# EAGLE design Energy SensorRevB (EAGLE 6.4)
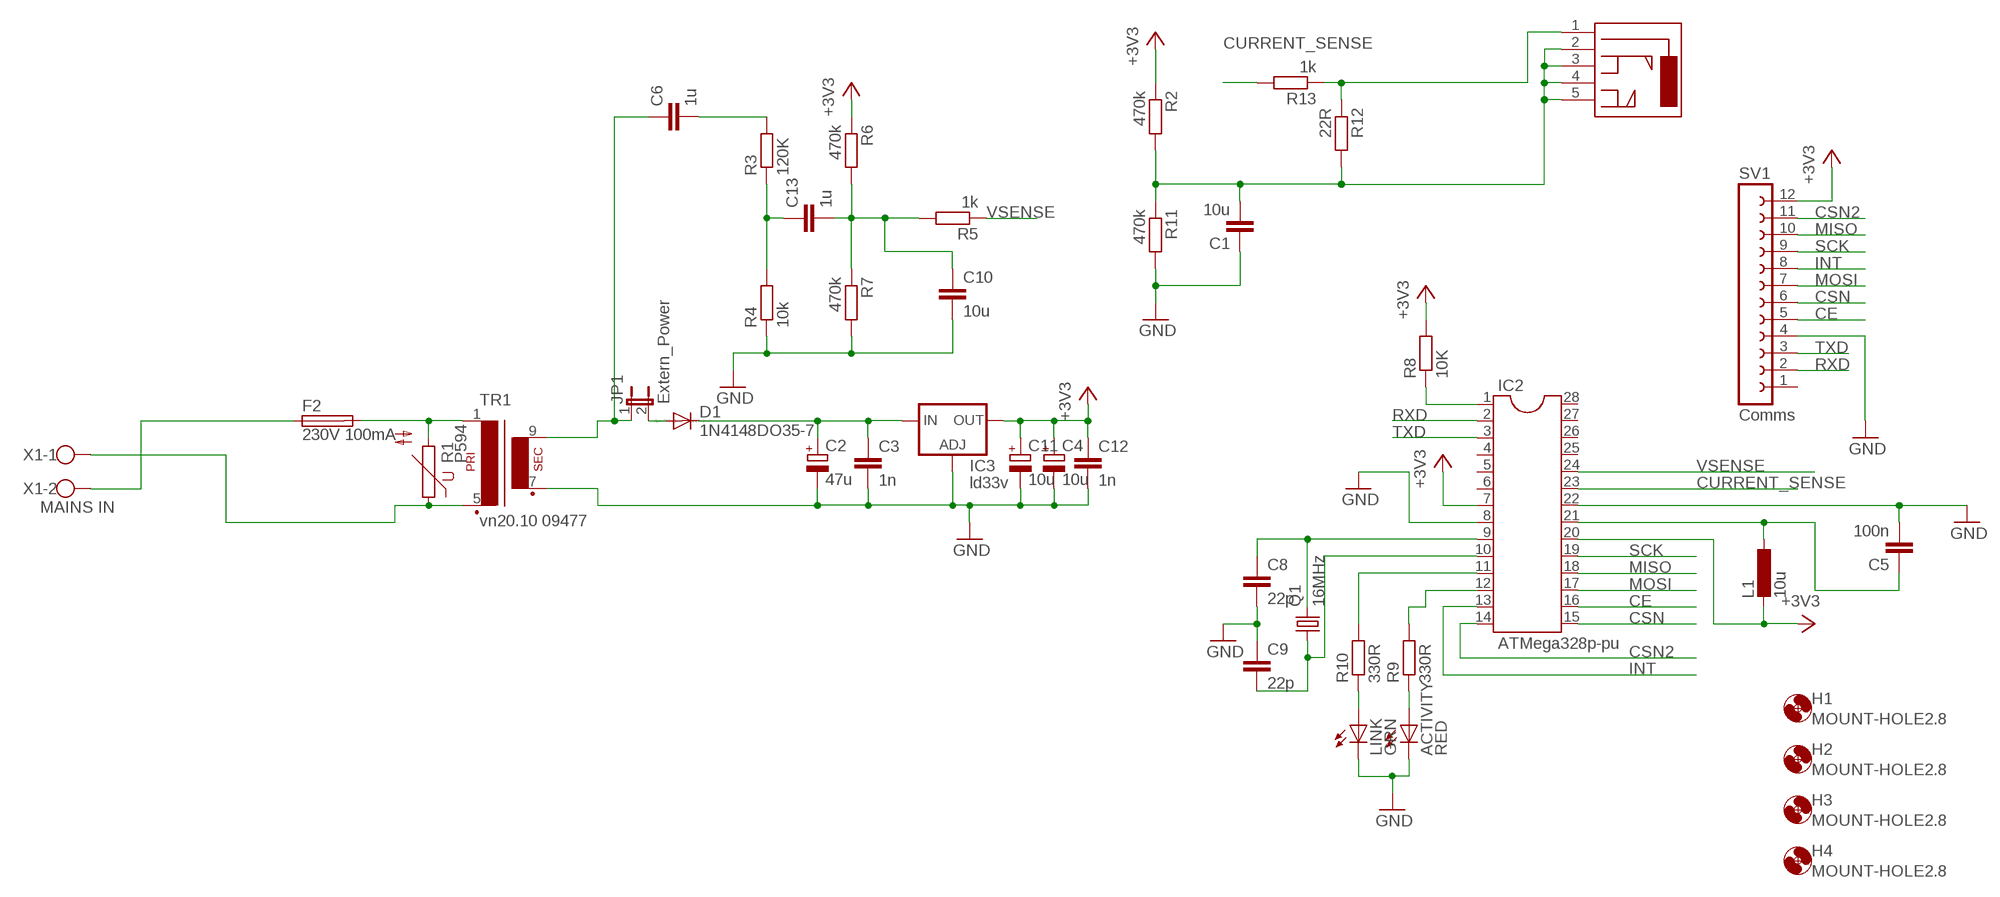
[diagram p0: schematic, sheet 1]

## Parts
ACTIVITY  RED  LED5MM  [LED5MM]
C1  10u  C-EUC1206K  [C1206K]
C2  47u  CPOL-EUE3.5-10  [E3,5-10]
C3  1n  C-EU025-025X050  [C025-025X050]
C4  10u  CPOL-EUE3.5-8  [E3,5-8]
C5  100n  C-EUC1206K  [C1206K]
C6  1u  C-EUC1206K  [C1206K]
C8  22p  C-EU025-025X050  [C025-025X050]
C9  22p  C-EU025-025X050  [C025-025X050]
C10  10u  C-EUC1206K  [C1206K]
C11  10u  CPOL-EUE3.5-8  [E3,5-8]
C12  1n  C-EU025-025X050  [C025-025X050]
C13  1u  C-EUC1206K  [C1206K]
D1  1N4148DO35-7  [DO35-7]
F2  230V 100mA  SH22,5A  [SH22,5A]
H1  MOUNT-HOLE2.8  [2,8]
H2  MOUNT-HOLE2.8  [2,8]
H3  MOUNT-HOLE2.8  [2,8]
H4  MOUNT-HOLE2.8  [2,8]
IC2  ATMega328p-pu  DIL28-3  [DIL28-3]
IC3  ld33v  LM317TL  [317TL]
JP1  Extern_Power  JP1E  [JP1]
L1  10u  L-EUL3230M  [L3230M]
LINK  GRN  LED5MM  [LED5MM]
Q1  16MHz  CRYSTALHC49S  [HC49/S]
R1  P594  [P594]
R2  470k  R-EU_0207/7  [0207/7]
R3  120K  R-EU_0207/7  [0207/7]
R4  10k  R-EU_0207/7  [0207/7]
R5  1k  R-EU_0207/7  [0207/7]
R6  470k  R-EU_0207/7  [0207/7]
R7  470k  R-EU_0207/7  [0207/7]
R8  10K  R-EU_0207/7  [0207/7]
R9  330R  R-EU_0207/7  [0207/7]
R10  330R  R-EU_0207/7  [0207/7]
R11  470k  R-EU_0207/7  [0207/7]
R12  22R  R-EU_R1206  [R1206]
R13  1k  R-EU_0207/7  [0207/7]
SV1  Comms  FE12W  [FE12W]
TR1  vn20.10 09477  VV11  [VV11]
U$1  3.5MMJACK  [3.5MMJACK]
X1  MAINS IN  W237-102  [W237-102]

## Nets
+3V3: C4.+ C11.+ C12.1 IC2.7 IC2.20 IC3.2(OUT) L1.2 R2.1 R6.1 R8.2 SV1.12
CE: IC2.16 SV1.5
CSN: IC2.15 SV1.6
CSN2: IC2.14 SV1.11
CURRENT_SENSE: IC2.23 R13.2
GND: ACTIVITY.K(C) C1.1 C2.- C3.2 C4.- C5.2 C8.2 C9.1 C10.2 C11.- C12.2 IC2.8 IC2.22 IC3.1(ADJ) LINK.K(C) R4.1 R7.2 R11.2 SV1.4 TR1.7(S3)
INT: IC2.13 SV1.8
MISO: IC2.18 SV1.10
MOSI: IC2.17 SV1.7
N$1: C1.2 R2.2 R11.1 R12.2 U$1.2 U$1.3 U$1.4 U$1.5
N$2: R1.1 TR1.5(P2) X1.1
N$3: D1.A JP1.2
N$4: C6.2 R3.2
N$5: C6.1 JP1.1 TR1.9(S4)
N$6: R12.1 R13.1 U$1.1
N$7: C2.+ C3.1 D1.C IC3.3(IN)
N$8: C5.1 IC2.21 L1.1
N$9: C13.1 R3.1 R4.2
N$10: C10.1 C13.2 R5.2 R6.2 R7.1
N$12: C8.1 IC2.9 Q1.2
N$13: C9.2 IC2.10 Q1.1
N$14: LINK.A R10.1
N$15: ACTIVITY.A R9.1
N$16: IC2.1 R8.1
N$17: IC2.12 R9.2
N$18: IC2.11 R10.2
N$19: F2.2 R1.2 TR1.1
N$22: F2.1 X1.2
RXD: IC2.2 SV1.2
SCK: IC2.19 SV1.9
TXD: IC2.3 SV1.3
VSENSE: IC2.24 R5.1
Unconnected: IC2.4 IC2.5 IC2.6 IC2.25 IC2.26 IC2.27 IC2.28 SV1.1

## Library data of the parts
ACTIVITY LINK = led:LED: LED OSRAM: - CHIPLED LG R971, LG N971, LY N971, LG Q971, LY Q971, LO R971, LY R971 LH N974, LH R974 LS Q976, LO Q976, LY Q976 LO Q996 - Hyper CHIPLED LW Q18S LB Q993, LB Q99A, LB R99A - SideLED LS A670, LO A670, LY A670, LG A670, LP A670 LB A673, LV A673, LT A673, LW A673 LH A674 LY A675 LS A676, LA A676, LO A676, LY A676, LW A676 LS A679, LY A679, LG A679 - Hyper Micro SIDELED® LS Y876, LA Y876, LO Y876, LY Y876 LT Y87S - SmartLED LW L88C, LW L88S LB L89C, LB L89S, LG L890 LS L89K, LO L89K, LY L89K LS L896, LA L896, LO L896, LY L896 - TOPLED LS T670, LO T670, LY T670, LG T670, LP T670 LSG T670, LSP T670, LSY T670, LOP T670, LYG T670 LG T671, LOG T671, LSG T671 LB T673, LV T673, LT T673, LW T673 LH T674 LS T676, LA T676, LO T676, LY T676, LB T676, LH T676, LSB T676, LW T676 LB T67C, LV T67C, LT T67C, LS T67K, LO T67K, LY T67K, LW E67C LS E67B, LA E67B, LO E67B, LY E67B, LB E67C, LV E67C, LT E67C LW T67C LS T679, LY T679, LG T679 LS T770, LO T770, LY T770, LG T770, LP T770 LB T773, LV T773, LT T773, LW T773 LH T774 LS E675, LA E675, LY E675, LS T675 LS T776, LA T776, LO T776, LY T776, LB T776 LHGB T686 LT T68C, LB T68C - Hyper Mini TOPLED® LB M676 - Mini TOPLED Santana® LG M470 LS M47K, LO M47K, LY M47K Source: http://www.osram.convergy.de LUXEON: - LUMILED® LXK2-PW12-R00, LXK2-PW12-S00, LXK2-PW14-U00, LXK2-PW14-V00 LXK2-PM12-R00, LXK2-PM12-S00, LXK2-PM14-U00 LXK2-PE12-Q00, LXK2-PE12-R00, LXK2-PE12-S00, LXK2-PE14-T00, LXK2-PE14-U00 LXK2-PB12-K00, LXK2-PB12-L00, LXK2-PB12-M00, LXK2-PB14-N00, LXK2-PB14-P00, LXK2-PB14-Q00 LXK2-PR12-L00, LXK2-PR12-M00, LXK2-PR14-Q00, LXK2-PR14-R00 LXK2-PD12-Q00, LXK2-PD12-R00, LXK2-PD12-S00 LXK2-PH12-R00, LXK2-PH12-S00 LXK2-PL12-P00, LXK2-PL12-Q00, LXK2-PL12-R00 Source: www.luxeon.com KINGBRIGHT: KA-3528ASYC Source: www.kingbright.com
C1 C3 C5 C6 C8-C10 C12 C13 = rcl:C-EU: CAPACITOR, European symbol
C2 C4 C11 = rcl:CPOL-EU: POLARIZED CAPACITOR, European symbol
D1 = diode:1N4148: DIODE high speed (Philips)
F2 = fuse:SH22,5A: FUSE HOLDER grid 22,5mm, isolated cap OGN0031 8201, Schurter (Buerklin); MPN: 0031.7701.11; OC_FARNELL: unknown; OC_NEWARK: 04F1224
H1-H4 = holes:MOUNT-HOLE: MOUNTING HOLE with drill center marker
IC2 = ic-package:DIL28: Dual In Line
IC3 = v-reg:LM317TL: VOLTAGE REGULATOR
JP1 = jumper:JP1E: JUMPER
L1 = rcl:L-EU: INDUCTOR, European symbol
Q1 = crystal:CRYSTAL: CRYSTAL; OC_FARNELL: 1667008; OC_NEWARK: unknown
R1 = varistor:P594: VARISTOR
R2-R13 = rcl:R-EU_: RESISTOR, European symbol
SV1 = con-lsta:FE12W: FEMALE HEADER; OC_FARNELL: unknown; OC_NEWARK: unknown
TR1 = xformer:VV11: TRANSFORMER 1 primary winding, 1 secondary winding BLOCK
U$1 = jack:3.5MMJACK
X1 = con-wago-500:W237-102: WAGO SCREW CLAMP; MPN: 237-102; OC_FARNELL: unknown; OC_NEWARK: 70K9898

## Board
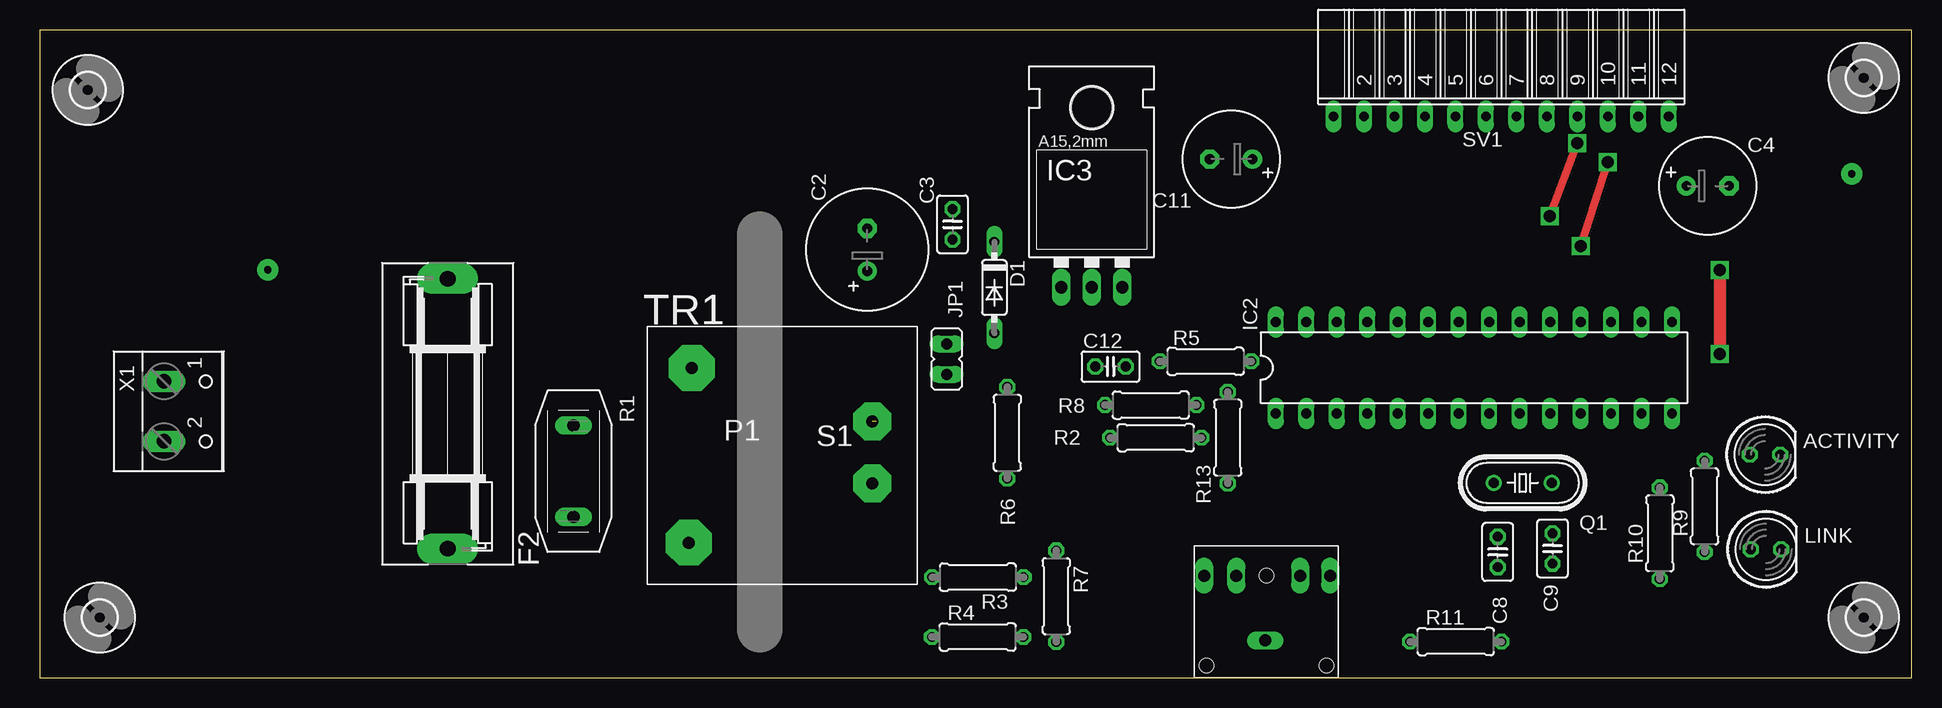
[diagram p1: board, top side]
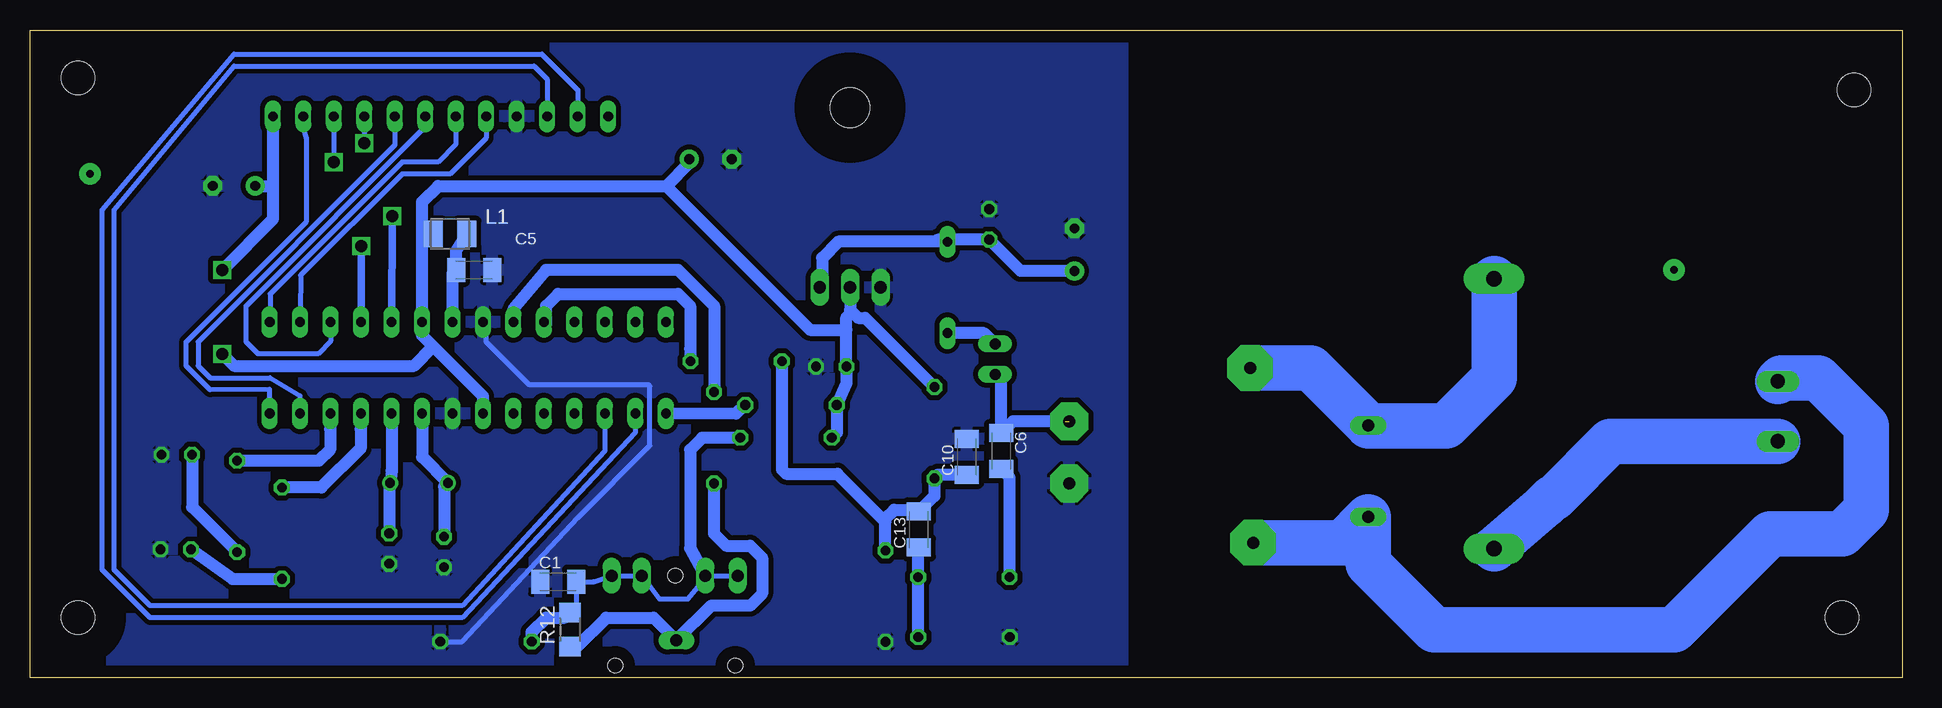
[diagram p2: board, bottom side, seen from below]

Size 156 x 54 mm. Coordinates in mm from the lower left corner, seen from the top.
Outline: 0,0 156,0 156,54 0,54 0,0
Copper layers (1*16): Top 0.035mm / dielectric 1.5mm / Bottom 0.035mm
Design rules "default": minimum track width 10mil, minimum drill 24mil, track to track 8mil, track to pad 8mil, pad to pad 8mil, via to via 8mil, smd to smd 8mil, copper to edge 40mil, drill to drill 8mil, minimum pad ring 10mil, minimum via ring 8mil, stop-mask expansion 4mil, vias tented up to drill 0mil, thermal gap 10mil

### Footprints (pad centres in the part's own frame; a part is rotated, then mirrored left to right if it is on the bottom)
LED5MM = drill 0.813 octagon: A -1.27,0; K 1.27,0
C1206K = smd 1.5 x 2: 1 -1.5,0; 2 1.5,0
E3,5-10 = drill 0.813 pad 1.6: + -1.778,0 | drill 0.813 pad 1.6 octagon: - 1.778,0
C025-025X050 = drill 0.813 octagon: 1 -1.27,0; 2 1.27,0
E3,5-8 = drill 0.813 pad 1.6: + -1.778,0 | drill 0.813 pad 1.6 octagon: - 1.778,0
DO35-7 = drill 0.813 long: A 3.81,0; C -3.81,0
SH22,5A = drill 1.321 pad 2.54 long: 1 -11.252,0; 2 11.252,0
2,8 = hole 2.8: 0,0
DIL28-3 = drill 0.813 long: 1 -16.51,-3.81; 2 -13.97,-3.81; 3 -11.43,-3.81; 4 -8.89,-3.81; 5 -6.35,-3.81; 6 -3.81,-3.81; 7 -1.27,-3.81; 8 1.27,-3.81; 9 3.81,-3.81; 10 6.35,-3.81; 11 8.89,-3.81; 12 11.43,-3.81; 13 13.97,-3.81; 14 16.51,-3.81; 15 16.51,3.81; 16 13.97,3.81; 17 11.43,3.81; 18 8.89,3.81; 19 6.35,3.81; 20 3.81,3.81; 21 1.27,3.81; 22 -1.27,3.81; 23 -3.81,3.81; 24 -6.35,3.81; 25 -8.89,3.81; 26 -11.43,3.81; 27 -13.97,3.81; 28 -16.51,3.81
317TL = drill 1.016 long: 1 -2.54,-3.81; 2 0,-3.81; 3 2.54,-3.81 | hole 3.302: 0,11.176
JP1 = drill 0.914 long: 1 0,-1.27; 2 0,1.27
L3230M = smd 1.6 x 2.2: 1 -1.4,0; 2 1.4,0
HC49/S = drill 0.813: 1 -2.413,0; 2 2.413,0
P594 = drill 1.016 long: 1 0,3.81; 2 0,-3.81
0207/7 = drill 0.813 octagon: 1 -3.81,0; 2 3.81,0
R1206 = smd 1.6 x 1.803: 1 -1.422,0; 2 1.422,0
FE12W = drill 0.813 long: 1 -13.97,0; 2 -11.43,0; 3 -8.89,0; 4 -6.35,0; 5 -3.81,0; 6 -1.27,0; 7 1.27,0; 8 3.81,0; 9 6.35,0; 10 8.89,0; 11 11.43,0; 12 13.97,0
VV11 = drill 1 pad 3.81 octagon: 1 3.687,18.043; 5 3.437,3.477 | drill 1 pad 3.175 octagon: 7 18.753,8.43; 9 18.753,13.59
3.5MMJACK = drill 1 long: 1 0.1,1.9; 2 5.2,-3.5; 3 2.5,-3.5; 4 -2.8,-3.5; 5 -5.3,-3.5 | hole 1.2: 5,4; -5,4; 0,-3.5
W237-102 = drill 1.194 long: 1 -2.5,-1.27; 2 2.5,-1.27

### Placement (x,y rotation side)
ACTIVITY  143.77,18.58 0 top
C1  112,8 0 bottom
C2  68.96,35.68 90 top
C3  76.07,37.79 90 top
C4  139,41 0 top
C5  119,34 0 bottom
C6  75.07,18.88 270 bottom
C8  121.5,10.47 270 top
C9  126.07,10.76 90 top
C10  77.93,18.41 90 bottom
C11  99.29,43.23 180 top
C12  89.23,25.93 0 top
C13  81.93,12.34 90 bottom
D1  79.55,32.53 270 top
F2  34,22 90 top
H1  4,49 0 top
H2  5,5 0 top
H3  152,5 0 top
H4  152,50 0 top
IC2  119.52,25.83 0 top
IC3  87.66,36.35 0 top
JP1  75.58,26.55 0 top
L1  121,37 180 bottom
LINK  143.85,10.69 0 top
Q1  123.58,16.23 180 top
R1  44.48,17.2 180 top
R2  93,20 0 top
R3  78.18,8.37 180 top
R4  78.16,3.38 0 top
R5  97.15,26.37 180 top
R6  80.63,20.41 270 top
R7  84.71,6.78 270 top
R8  92.58,22.72 180 top
R9  138.74,14.27 90 top
R10  135.01,12.03 90 top
R11  118,3 0 top
R12  111,4 90 bottom
R13  99,20 90 top
SV1  121.79,46.8 0 top
TR1  50.64,7.77 0 top
U$1  102.23,5 180 top
X1  11.62,22.2 270 top

### Tracks (layer width: path | path; a pad name or v marks a point on that pad's centre or on a via)
+3V3  (via drill 1)
  Top 1.016: v140,34 v140,27
  Bottom 1.016: IC2.7 118.25,23.45 122.4,27.6 | 122.4,27.6 123.33,28.53 IC2.20 123.33,36.62 | IC3.2 87.66,30.66 87.5,30.5 | 87.5,30.5 87,30 86.41,30 R6.1 | 87.96,29 C12.1 87.96,24.53 R8.2 88.77,20.42 R2.1 | 87.96,29 87.96,30.04 87.5,30.5 | 123.33,36.62 L1.2 | SV1.12 135.76,41 | 135.76,41 135.76,38.24 v140,34 | v140,27 139,26 124,26 122.4,27.6 | 123.33,36.62 123.33,39.67 122,41 103,41 | 103,41 91,29 87.96,29 | C11.+ 101.07,42.93 103,41 | C4.+ 135.76,41
CE
  Bottom 0.406: SV1.5 118,46.78 118,45 121,42 125,42 133.45,33.55 133.49,30.51 IC2.16
CSN
  Bottom 0.406: IC2.15 136,29.67 136,32 125,43 122,43 120.52,44.48 SV1.6
CSN2
  Bottom 0.406: IC2.14 136.03,24.03 141,24 143,26 143,28 133,38 133,45 133.22,45.78 SV1.11
CURRENT_SENSE
  Bottom 1.016: IC2.23 115.71,30.71 113,34 102,34 99,31 R13.2
GND
  Bottom 0.406: R11.2 120,3 110.3,13.35 104.35,19.35 104.35,24.3 104.45,24.4 114.4,24.4 118,28 118,29.39 IC2.22
  Bottom 1.016: TR1.7 69.39,16
  pour Bottom (isolate 0.406): 65,62 65,1 158,1 158,62
INT
  Bottom 0.406: IC2.13 133.49,23.49 136,25 141,25 142,26 142,28 125.6,44.4 SV1.8
MISO  (via drill 1)
  Top 0.61: v128.41,36 v130.68,43
  Bottom 0.406: SV1.10 v130.68,43
  Bottom 0.61: IC2.18 v128.41,36
MOSI
  Bottom 0.406: SV1.7 123.06,45.94 138,31 138,28 137,27 132,27 130.95,28.05 IC2.17
N$1
  Bottom 0.406: U$1.2 U$1.3 99.73,8.27 101.15,6.55 103.55,6.55 105,8.47 U$1.4 U$1.5 109.03,8 C1.2 110.5,5.92 R12.2
  Bottom 1.016: U$1.3 101,10.77 101,19 100,20 R2.2 | R11.1 114.19,3.81 113,5 111.42,5 R12.2
N$2
  Bottom 3.81: TR1.5 46.62,11.25 R1.1 44.48,9.48 39,4 19,4 11,12 5,12 3,14 3,21 7,25 10.05,25 X1.1
N$3
  Bottom 1.016: JP1.2 76.48,28.72 D1.A
N$4
  Bottom 1.016: R3.2 74.37,16.68 C6.2
N$5  (1 unrouted)
  Bottom 1.016: 69.72,21.36 74.09,21.36 C6.1 75.07,24.77 JP1.1
N$6
  Bottom 1.016: R13.1 99,12 98,11 96,11 95,10 95,7 96,6 99.23,6 U$1.1 104.03,5 108,5 110.42,2.58 R12.1
N$7
  Bottom 1.016: C2.+ 73.45,33.9 C3.1 80.37,36.52 D1.C 88.66,36.34 90,35 90,32.74 IC3.3
N$8
  Bottom 1.016: IC2.21 120.79,33.71 C5.1 120.5,35.55 L1.1
N$9
  Bottom 1.016: R4.2 81.97,8.35 R3.1 81.99,10.78 C13.1
N$10
  Bottom 1.016: R7.1 84.71,13 | 84.71,13 84.71,13.29 84,14 82.09,14 C13.2 80.63,15.14 R6.2 80.32,16.91 C10.1 | R5.2 93.34,17.34 93,17 88.71,17 84.71,13
N$12
  Bottom 1.016: C8.1 121.5,15.9 Q1.2 123.33,18.39 IC2.9
N$13
  Bottom 1.016: IC2.10 125.87,17.23 Q1.1 126.07,16.15 C9.2
N$14
  Bottom 1.016: LINK.A 139.11,8.22 R10.1
N$15
  Bottom 1.016: ACTIVITY.A 142.5,14.22 R9.1
N$16
  Bottom 1.016: R8.1 97.18,22 IC2.1
N$17
  Bottom 1.016: IC2.12 131,20.7 131,19 131.92,18.08 R9.2
N$18
  Bottom 1.016: IC2.11 128.45,20.71 128.45,19.1 131.71,15.84 R10.2
N$19
  Bottom 3.81: TR1.1 49.28,25.81 R1.2 38,21 34,25 F2.2
N$20  (via drill 0.6 pad 1.78)
  other vias: 151,42
N$21  (via drill 0.6 pad 1.78)
  other vias: 19,34
N$22
  Bottom 3.81: F2.1 29.79,14.34 29.13,15 29,15 24.3,19.7 X1.2
RXD
  Bottom 0.406: IC2.2 105.55,20.45 120,5 146,5 150,9 150,39 139,52 113.35,52 110.35,49 110.35,48 110.36,47.99 SV1.2
SCK  (via drill 1)
  Top 0.61: v125.82,38.5 v128.14,44.55
  Bottom 0.406: SV1.9 v128.14,44.55
  Bottom 0.61: IC2.19 v125.82,38.5
TXD
  Bottom 0.406: IC2.3 108.09,18.91 120,6 146,6 149,9 149,39 139,51 114,51 112.9,49.9 SV1.3
VSENSE
  Bottom 1.016: IC2.24 113,29.47 113,31 112,32 102,32 101,31 101,27.41 R5.1

### Text on the board
Document: MAINS | N | L
tDocu: 2015 | SmartHome | Energy Meter Rev B.